# EAGLE design serial_extender (EAGLE 6.1)
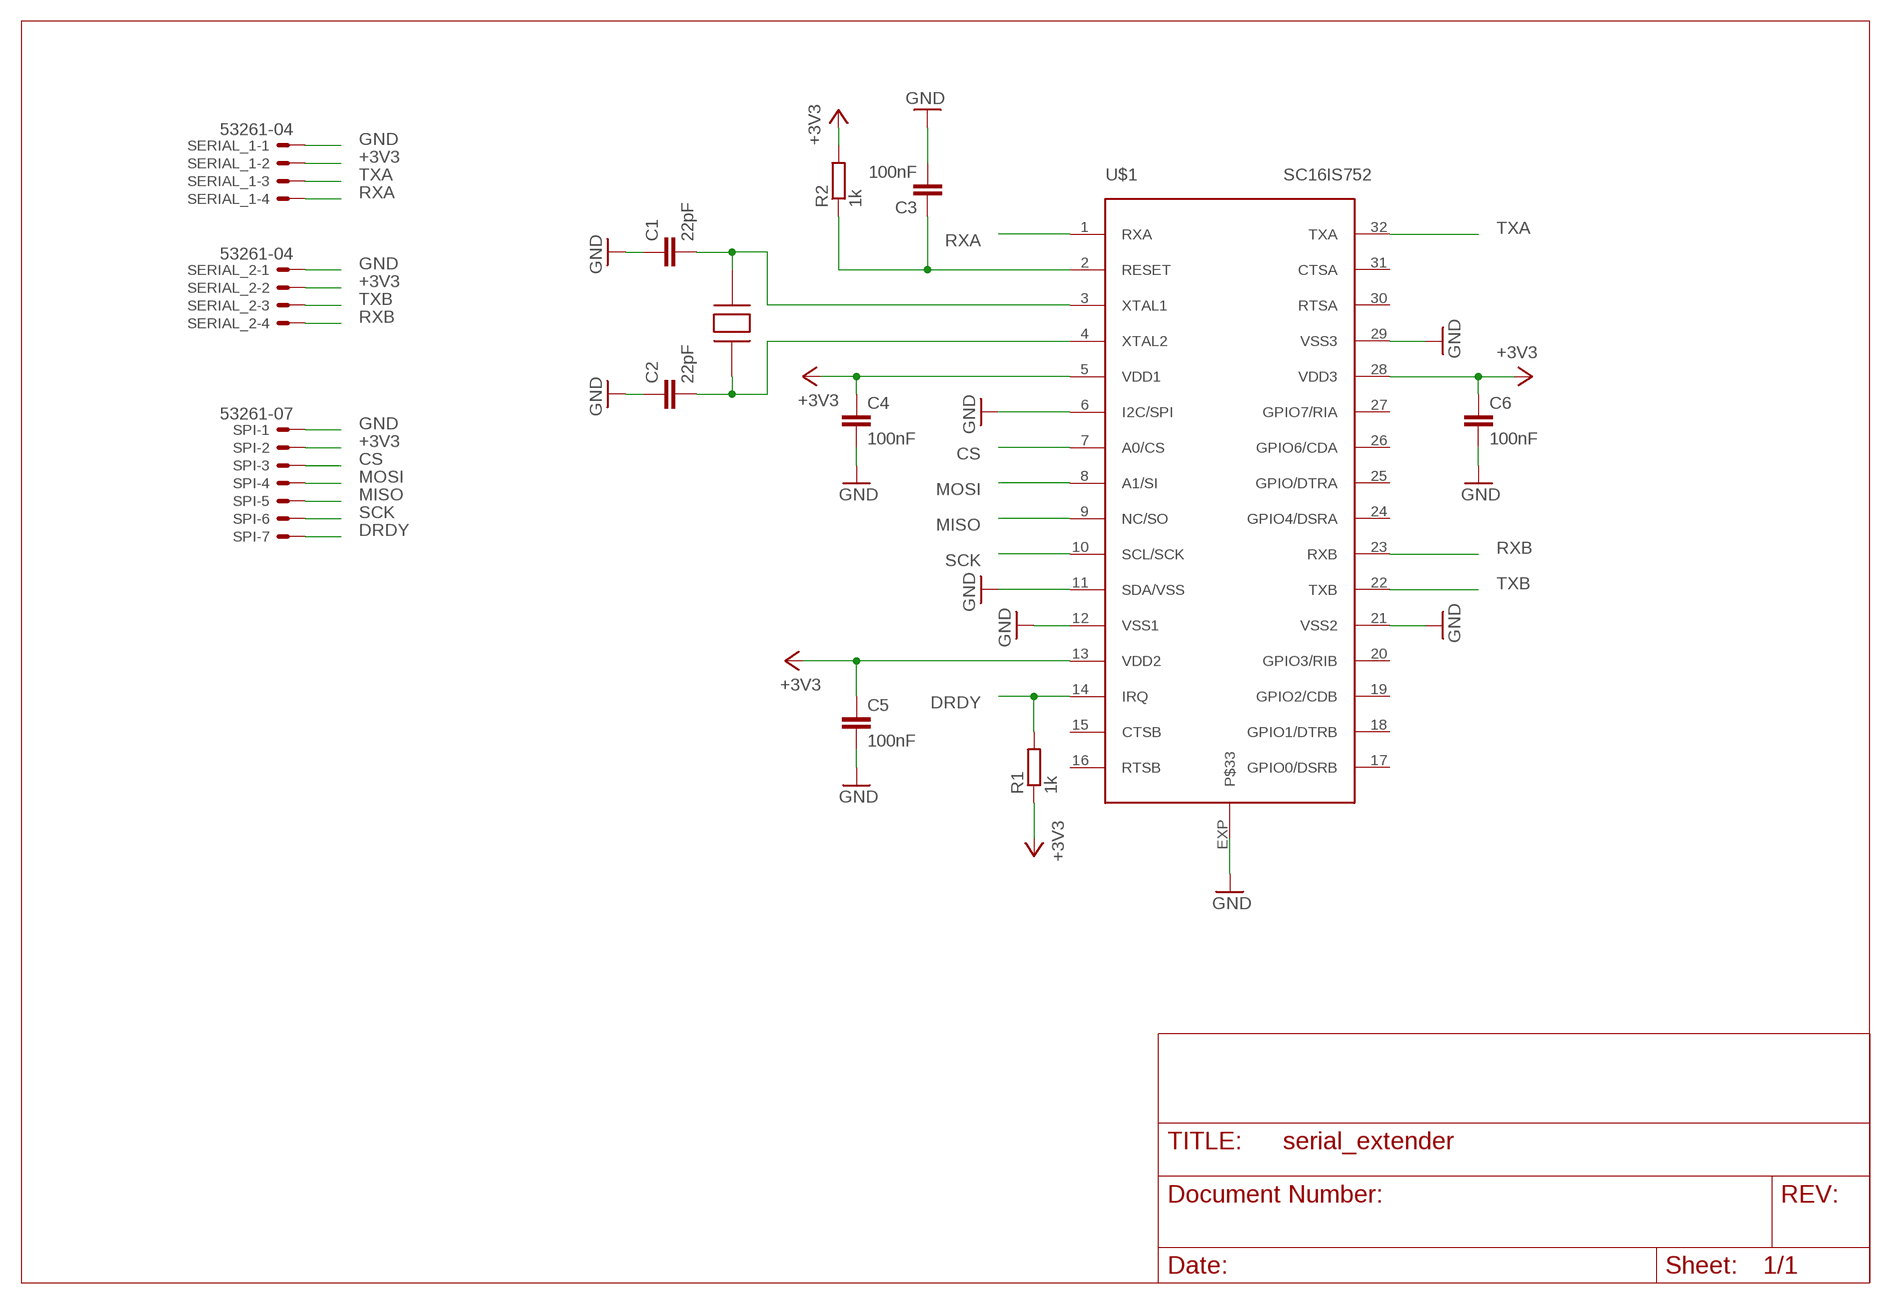
[diagram p0: schematic, sheet 1]

## Parts
C1  22pF  C-EUC0603K  [C0603K]
C2  22pF  C-EUC0603K  [C0603K]
C3  100nF  C-EUC0603K  [C0603K]
C4  100nF  C-EUC0603K  [C0603K]
C5  100nF  C-EUC0603K  [C0603K]
C6  100nF  C-EUC0603K  [C0603K]
R1  1k  R-EU_R0603  [R0603]
R2  1k  R-EU_R0603  [R0603]
SERIAL_1  53261-04  [53261-04]
SERIAL_2  53261-04  [53261-04]
SPI  53261-07  [53261-07]
U$1  SC16IS752  [HVQFN32]
U$2  CRYSTAL_CTS  [CTS_CRYSTAL]

## Nets
+3V3: C4.1 C5.1 C6.1 R1.1 R2.2 SERIAL_1.2 SERIAL_2.2 SPI.2 U$1.5(VDD1) U$1.13(VDD2) U$1.28(VDD3)
CS: SPI.3 U$1.7(A0/CS)
DRDY: R1.2 SPI.7 U$1.14(IRQ)
GND: C1.1 C2.1 C3.2 C4.2 C5.2 C6.2 SERIAL_1.1 SERIAL_2.1 SPI.1 U$1.6(I2C/SPI) U$1.11(SDA/VSS) U$1.12(VSS1) U$1.21(VSS2) U$1.29(VSS3) U$1.EXP
MISO: SPI.5 U$1.9(NC/SO)
MOSI: SPI.4 U$1.8(A1/SI)
N$1: C1.2 U$1.3(XTAL1) U$2.P$3
N$2: C2.2 U$1.4(XTAL2) U$2.P$1
N$3: C3.1 R2.1 U$1.2(RESET)
RXA: SERIAL_1.4 U$1.1(RXA)
RXB: SERIAL_2.4 U$1.23(RXB)
SCK: SPI.6 U$1.10(SCL/SCK)
TXA: SERIAL_1.3 U$1.32(TXA)
TXB: SERIAL_2.3 U$1.22(TXB)
Unconnected: U$1.15(CTSB) U$1.16(RTSB) U$1.17(GPIO0/DSRB) U$1.18(GPIO1/DTRB) U$1.19(GPIO2/CDB) U$1.20(GPIO3/RIB) U$1.24(GPIO4/DSRA) U$1.25(GPIO/DTRA) U$1.26(GPIO6/CDA) U$1.27(GPIO7/RIA) U$1.30(RTSA) U$1.31(CTSA)

## Library data of the parts
C1-C6 = rcl:C-EU: CAPACITOR, European symbol
R1 R2 = rcl:R-EU_: RESISTOR, European symbol
SERIAL_1 SERIAL_2 = con-molex:53?-04: CONNECTOR wire to board 1.25 mm (.049 inch) pitch header
SPI = con-molex:53?-07: CONNECTOR wire to board 1.25 mm (.049 inch) pitch header
U$1 = paparazzi:SC16IS752
U$2 = paparazzi:CRYSTAL_CTS

## Board
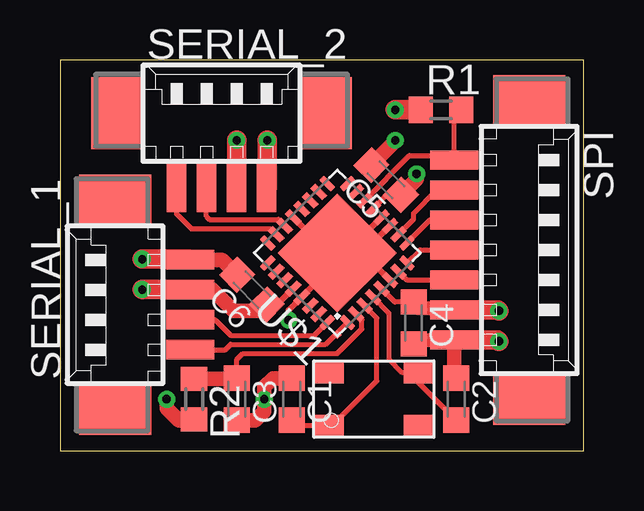
[diagram p1: board, top side]
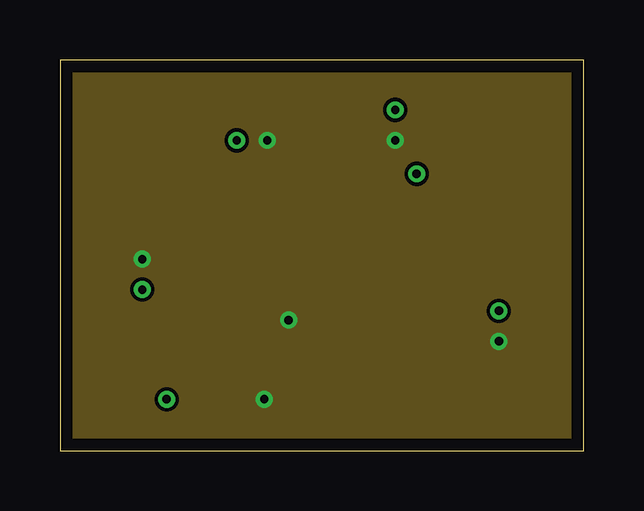
[diagram p2: board, inner layer Route2]
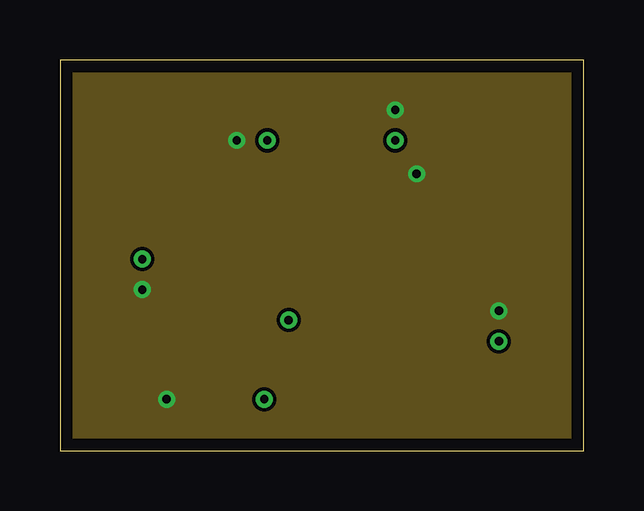
[diagram p3: board, inner layer Route15]

Size 21.82 x 16.31 mm. Coordinates in mm from the lower left corner, seen from the top.
Outline: 0,0 21.82,0 21.82,16.31 0,16.31 0,0
Copper layers (1*2+15*16): Top 0.035mm / dielectric 0.2mm / Route2 0.035mm / dielectric 1.5mm / Route15 0.035mm / dielectric 0.2mm / Bottom 0.035mm
Design rules: minimum track width 0.15mm, minimum drill 0.35mm, track to track 0.15mm, track to pad 0.15mm, pad to pad 0.15mm, via to via 0.15mm, smd to smd 0.15mm, copper to edge 20mil, drill to drill 8mil, minimum pad ring 0.177mm, minimum via ring 0.177mm, stop-mask expansion 4mil, vias tented up to drill 14mil, thermal gap 10mil

### Footprints (pad centres in the part's own frame; a part is rotated, then mirrored left to right if it is on the bottom)
C0603K = smd 1.05 x 1.08: 1 -0.875,0; 2 0.875,0
R0603 = smd 1 x 1.1: 1 -0.85,0; 2 0.85,0
53261-04 = smd 0.8 x 2: 1 1.875,-2.5; 2 0.625,-2.5; 3 -0.625,-2.5; 4 -1.875,-2.5 | smd 2.1 x 3: S1 4.375,0.625; S2 -4.375,0.625
53261-07 = smd 0.8 x 2: 1 3.75,-2.5; 2 2.5,-2.5; 3 1.25,-2.5; 4 0,-2.5; 5 -1.25,-2.5; 6 -2.5,-2.5; 7 -3.75,-2.5 | smd 2.1 x 3: S1 6.25,0.625; S2 -6.25,0.625
HVQFN32 = smd 0.7 x 0.28: 1 -2.35,1.75; 2 -2.35,1.25; 3 -2.35,0.75; 4 -2.35,0.25; 5 -2.35,-0.25; 6 -2.35,-0.75; 7 -2.35,-1.25; 8 -2.35,-1.75; 17 2.35,-1.75; 18 2.35,-1.25; 19 2.35,-0.75; 20 2.35,-0.25; 21 2.35,0.25; 22 2.35,0.75; 23 2.35,1.25; 24 2.35,1.75 | smd 0.28 x 0.7: 9 -1.75,-2.35; 10 -1.25,-2.35; 11 -0.75,-2.35; 12 -0.25,-2.35; 13 0.25,-2.35; 14 0.75,-2.35; 15 1.25,-2.35; 16 1.75,-2.35; 25 1.75,2.35; 26 1.25,2.35; 27 0.75,2.35; 28 0.25,2.35; 29 -0.25,2.35; 30 -0.75,2.35; 31 -1.25,2.35; 32 -1.75,2.35 | smd 3.5 x 3.5: EXP 0,0 | smd 0.25 x 0.25: M1 -2.415,2.415
CTS_CRYSTAL = smd 1.2 x 0.9: P$1 -1.85,-1.1; P$2 1.85,-1.1; P$3 1.85,1.1; P$4 -1.85,1.1

### Placement (x,y rotation side)
C1  9.65,2.16 270 top
C2  16.51,2.16 270 top
C3  7.37,2.16 270 top
C4  14.73,5.33 270 top
C5  13.59,11.3 135 top
C6  8,6.73 135 top
R1  15.88,14.22 0 top
R2  5.59,2.16 270 top
SERIAL_1  2.92,6.1 90 top
SERIAL_2  6.73,13.46 0 top
SPI  18.92,8.38 270 top
U$1  11.56,8.25 135 top
U$2  13.08,2.16 180 top

### Tracks (layer width: path | path; a pad name or v marks a point on that pad's centre or on a via)
+3V3  (via drill 0.35 pad 0.35)
  Top 0.203: 14.86,5.97 14.73,6.1 C4.1 13.96,6.21 U$1.5 | U$1.13 13.63,10.68 C5.1
  Top 0.254: U$1.28 9.06,6.11 C6.1
  Top 0.584: 14.86,5.97 16.34,5.97 SPI.2
  Top 0.61: C5.1 14.86,11.34 v14.86,11.56 | SERIAL_1.2 6.35,6.73 7.24,5.84 8.35,5.84 C6.1 | v4.45,2.16 4.45,1.78 4.95,1.27 5.55,1.27 R2.2
  Top 0.813: SPI.2 18.25,5.88 v18.29,5.84 | SERIAL_2.2 v7.37,12.95 | SERIAL_1.2 v3.43,6.73 | R1.1 v13.97,14.22
  pour Route15: 0.38,16.51 21.97,16.51 21.97,0.25 0.38,0.25
CS
  Top 0.203: U$1.7 14.45,7.13 SPI.3
DRDY
  Top 0.203: 16.42,13.97 SPI.7 15.81,12.13 15.62,12.32 14.56,12.32 U$1.14
  Top 0.305: R1.2 16.42,14.22 16.42,13.97
GND  (via drill 0.35)
  Top 0.254: U$1.21 11.2,8.25 U$1.EXP | U$1.12 11.91,8.25 U$1.EXP | 12.62,8.25 U$1.11 | U$1.EXP 12.62,8.25 | 12.62,8.25 U$1.6 | U$1.EXP 12.62,8.25 | U$1.EXP 11.56,7.9 U$1.29 9.52,5.87 v9.52,5.46
  Top 0.584: SPI.1 14.61,4.63 14.61,4.57 14.72,4.46 C4.2
  Top 0.61: C5.2 13.97,12.92 v13.97,12.95 | SERIAL_1.1 6.76,7.97 C6.2 | SPI.1 16.42,3.12 C2.1 | C1.1 8.88,3.03 8.51,2.67 v8.51,2.16 8.51,1.65 8.14,1.28 C3.2 | C4.2 14.78,4.46 14.78,4.63
  Top 0.813: SPI.1 18.23,4.63 v18.29,4.57 | SERIAL_2.1 8.64,10.99 v8.64,12.95 | SERIAL_1.1 5.39,8 v3.43,8
  pour Route2: 0.38,16.51 21.97,16.51 21.97,0.25 0.38,0.25
MISO
  Top 0.203: U$1.9 15.41,9.63 SPI.5
MOSI
  Top 0.203: U$1.8 15.01,8.38 SPI.4
N$1
  Top 0.203: C1.2 9.65,1.06 U$2.P$3 11.35,1.06 13.21,2.92 13.21,5.54 U$1.3
N$2
  Top 0.203: U$1.4 13.72,5.74 13.72,3.81 14.27,3.26 U$2.P$1 14.93,2.86 C2.2
N$3
  Top 0.203: U$1.2 12.57,5.47 12.57,5.08 11.56,4.06 7.62,4.06 7.37,3.81 C3.1 7.34,3.01
  Top 0.61: 7.34,3.01 R2.1
RXA
  Top 0.203: U$1.1 11.07,4.45 7.11,4.45 6.89,4.22 SERIAL_1.4
RXB
  Top 0.203: U$1.23 8.77,9.27 5.46,9.27 4.86,9.88 SERIAL_2.4
SCK
  Top 0.203: U$1.10 14.73,9.66 14.73,9.91 15.71,10.88 SPI.6
TXA
  Top 0.203: U$1.32 10.6,4.83 7.11,4.83 6.47,5.47 SERIAL_1.3
TXB
  Top 0.203: U$1.22 9.1,9.65 6.22,9.65 6.1,9.78 6.1,10.95 SERIAL_2.3